# Altium schematic sheet 电源模块.SchDoc
size A3
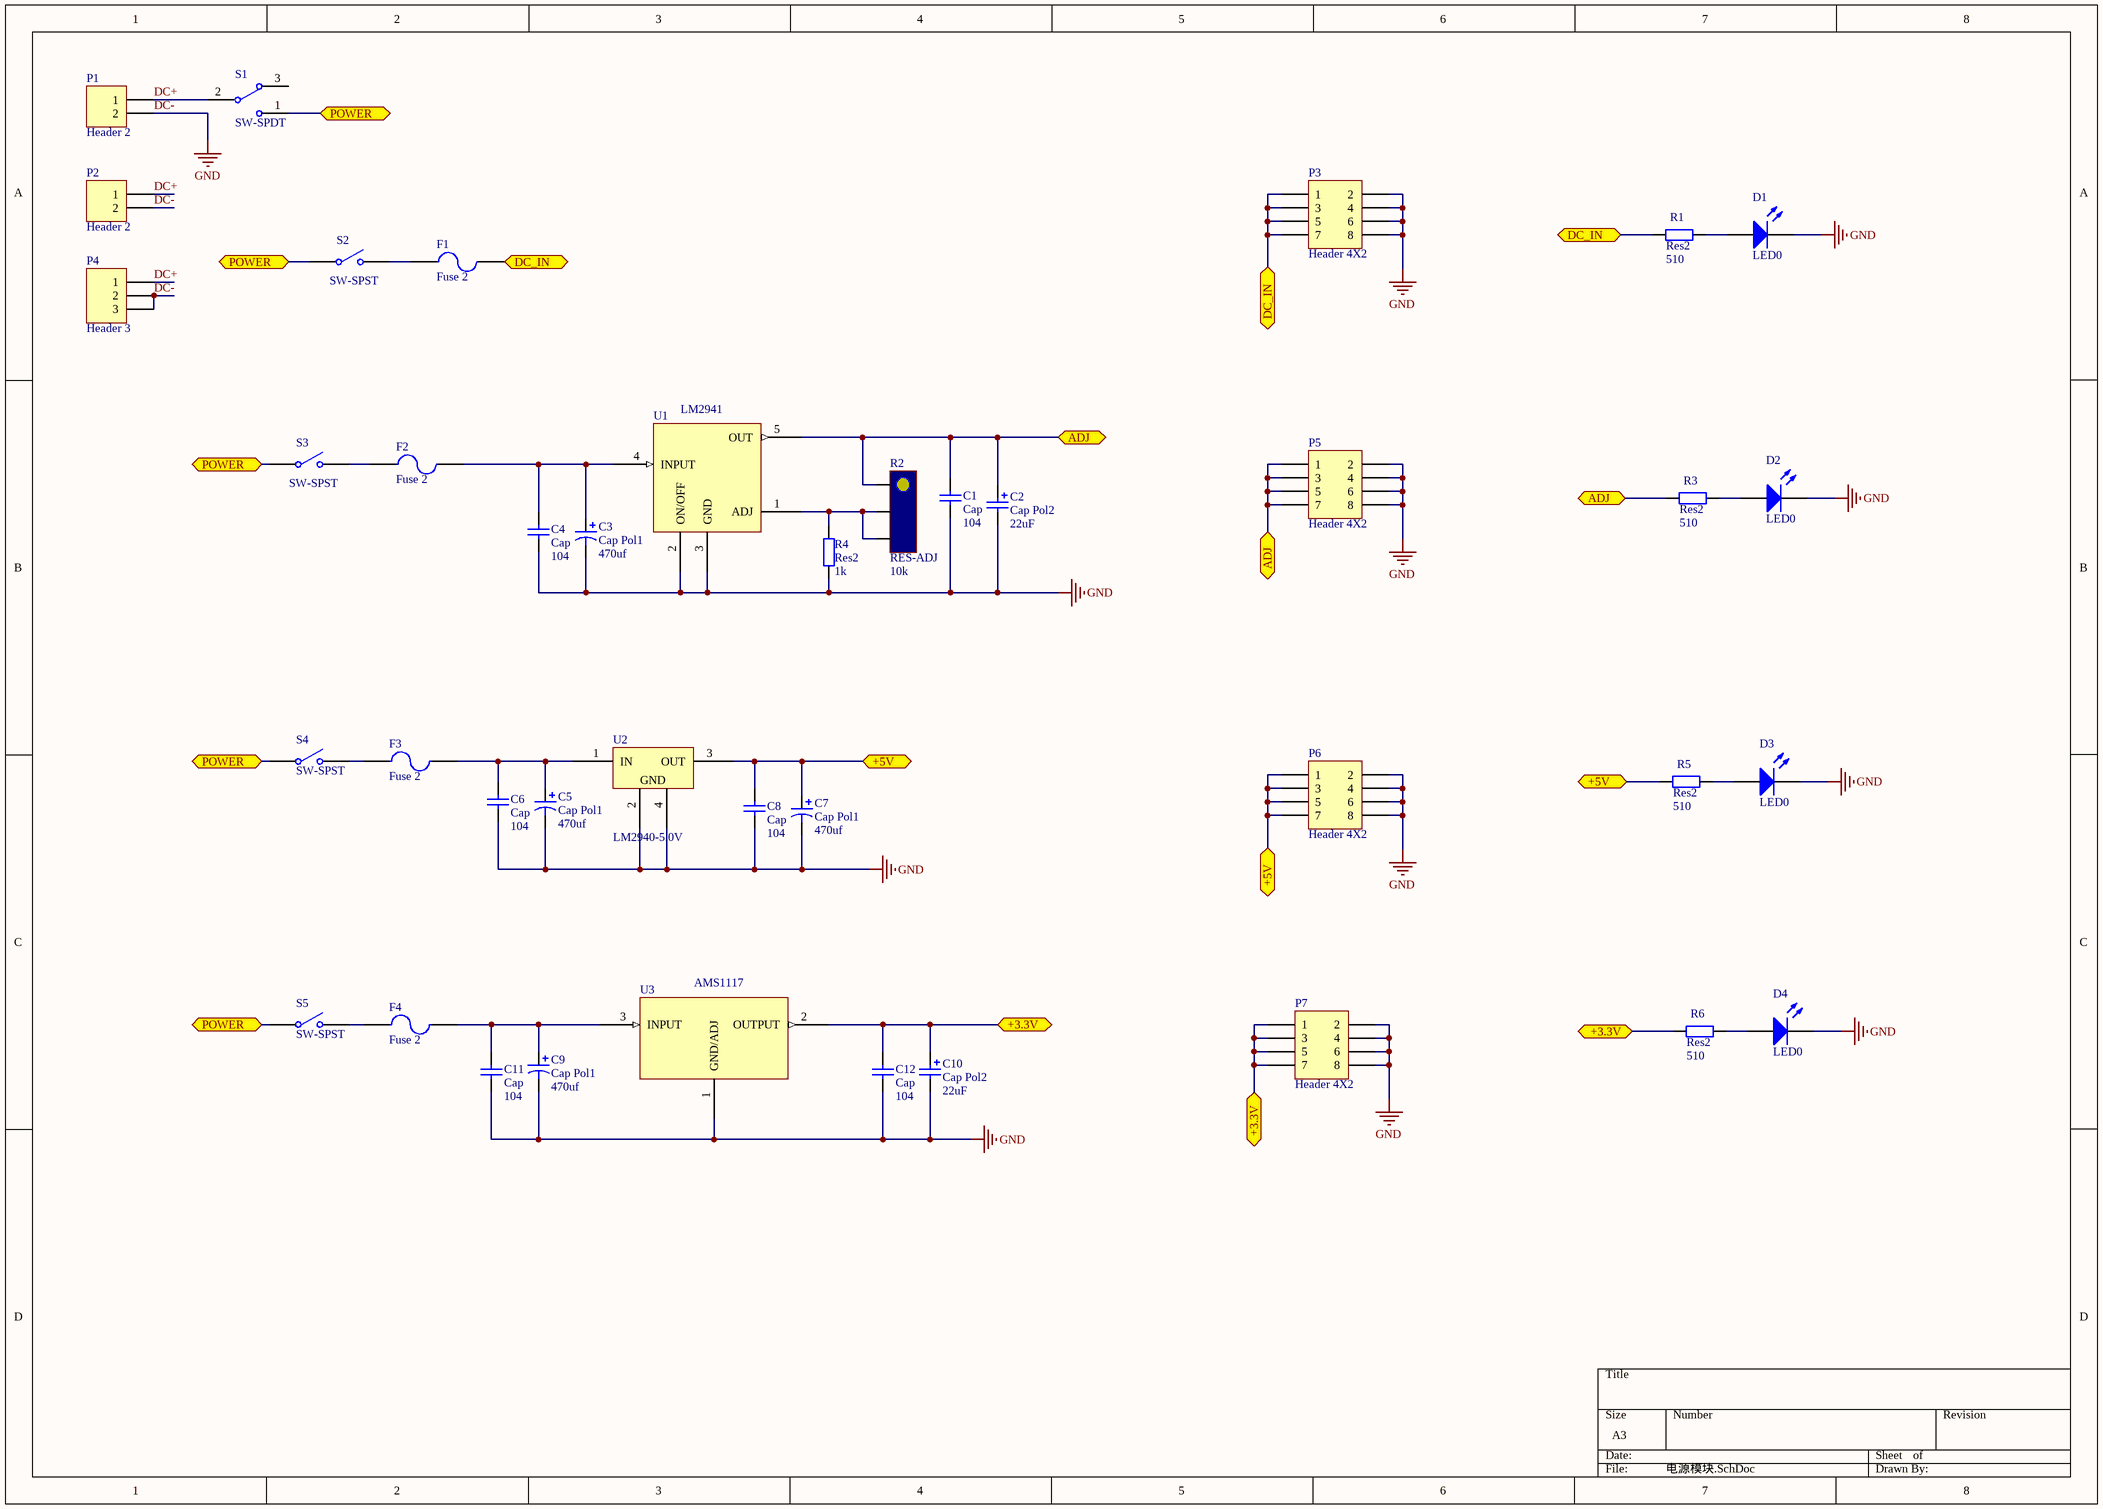
[diagram p0: 电源模块.SchDoc]

## Parts
C1  Cap  value 104  [C-0805]
C2  Cap Pol2  value 22uF  [C-RB-8]
C3  Cap Pol1  value 470uf  [CAP-E1]
C4  Cap  value 104  [C-0805]
C5  Cap Pol1  value 470uf  [CAP-E1]
C6  Cap  value 104  [C-0805]
C7  Cap Pol1  value 470uf  [CAP-E1]
C8  Cap  value 104  [C-0805]
C9  Cap Pol1  value 470uf  [CAP-E1]
C10  Cap Pol2  value 22uF  [C-RB-8]
C11  Cap  value 104  [C-0805]
C12  Cap  value 104  [C-0805]
D1  LED0  [LED]
D2  LED0  [LED]
D3  LED0  [LED]
D4  LED0  [LED]
F1  Fuse 2  [1206]
F2  Fuse 2  [1206]
F3  Fuse 2  [1206]
F4  Fuse 2  [1206]
P1  Header 2  [T型插头(公)]
P2  Header 2  [HDR1X2]
P3  Header 4X2  [HDR2X4]
P4  Header 3  [DC-005]
P5  Header 4X2  [HDR2X4]
P6  Header 4X2  [HDR2X4]
P7  Header 4X2  [HDR2X4]
R1  Res2  value 510  [0805]
R2  RES-ADJ  value 10k  [RES_V]
R3  Res2  value 510  [0805]
R4  Res2  value 1k  [0805]
R5  Res2  value 510  [0805]
R6  Res2  value 510  [0805]
S1  SW-SPDT  [SWITCH_B]
S2  SW-SPST  [SW-6pin]
S3  SW-SPST  [SW-6pin]
S4  SW-SPST  [SW-6pin]
S5  SW-SPST  [SW-6pin]
U1  LM2941  [LM2941]
U2  LM2940-5.0V  [TO-263-3]
U3  AMS1117  [AMS1117]

## Ports
+3.3V, +5V, ADJ, DC_IN, POWER

## Nets
DC-: C1.2 C2.2 C3.2 C4.2 C5.2 C6.2 C7.2 C8.2 C9.2 C10.2 C11.2 C12.2 D1.2(K) D2.2(K) D3.2(K) D4.2(K) P1.2 P2.2 P3.2 P3.4 P3.6 P3.8 P4.2 P4.3 P5.2 P5.4 P5.6 P5.8 P6.2 P6.4 P6.6 P6.8 P7.2 P7.4 P7.6 P7.8 R4.1 U1.2(ON/OFF) U1.3(GND) U2.2(GND) U2.4(GND) U3.1(GND/ADJ)  [also labelled GND]
+3.3V: C10.1 C12.1 P7.1 P7.3 P7.5 P7.7 R6.1 U3.2(OUTPUT) ; port +3.3V
+5V: C7.1 C8.1 P6.1 P6.3 P6.5 P6.7 R5.1 U2.3(OUT) ; port +5V
ADJ: C1.1 C2.1 P5.1 P5.3 P5.5 P5.7 R2.3 R3.1 U1.5(OUT) ; port ADJ
DC+: P1.1 P2.1 P4.1 S1.2
DC_IN: F1.2 P3.1 P3.3 P3.5 P3.7 R1.1 ; port DC_IN
POWER: S1.1 S2.1(COMMON) S3.1(COMMON) S4.1(COMMON) S5.1(COMMON) ; port POWER
NetC3_1: C3.1 C4.1 F2.2 U1.4(INPUT)
NetC5_1: C5.1 C6.1 F3.2 U2.1(IN)
NetC9_1: C9.1 C11.1 F4.2 U3.3(INPUT)
NetD1_1: D1.1(A) R1.2
NetD2_1: D2.1(A) R3.2
NetD3_1: D3.1(A) R5.2
NetD4_1: D4.1(A) R6.2
NetF1_1: F1.1 S2.2(NO)
NetF2_1: F2.1 S3.2(NO)
NetF3_1: F3.1 S4.2(NO)
NetF4_1: F4.1 S5.2(NO)
NetR2_1: R2.1 R2.2 R4.2 U1.1(ADJ)

Not connected (* = marked no-connect by the designer): S1 3

## Library data of the parts
C1 C4 C6 C8 C11 C12 = Cap: Capacitor; Published: 8-Jun-2000; LatestRevisionDate: 17-Jul-2002; LatestRevisionNote: Re-released for DXP Platform.; PackageReference: RAD-0.3; Publisher: Altium Limited; PackageDescription: Radial Cap, Thru-Hole; 2 Leads; 0.3 in Pin Spacing
C2 C10 = Cap Pol2: Polarized Capacitor (Axial); Published: 8-Jun-2000; LatestRevisionDate: 17-Jul-2002; LatestRevisionNote: Re-released for DXP Platform.; PackageReference: POLAR0.8; Publisher: Altium Limited; PackageDescription: Polarized Capacitor; 2 Leads
C3 C5 C7 C9 = Cap Pol1: Polarized Capacitor (Radial); Published: 8-Jun-2000; LatestRevisionDate: 17-Jul-2002; LatestRevisionNote: Re-released for DXP Platform.; PackageReference: RB7.6-15; Publisher: Altium Limited; PackageDescription: Polarized Capacitor (Radial); 2 Leads
D1-D4 = LED0: Typical INFRARED GaAs LED; Published: 8-Jun-2000; LatestRevisionDate: 08-Jul-2005; LatestRevisionNote: Mech Layer 1 removed.; PackageReference: LED-0; Publisher: Altium Limited; PackageDescription: LED; 2 Leads
F1-F4 = Fuse 2: Fuse; Published: 8-Jun-2000; LatestRevisionDate: 17-Jul-2002; LatestRevisionNote: Re-released for DXP Platform.; PackageReference: PIN-W2/E2.8; Publisher: Altium Limited; PackageDescription: Thru-Hole; 2 Leads
P1 P2 = Header 2: Header, 2-Pin; LatestRevisionDate: 17-Jul-2002; LatestRevisionNote: Re-released for DXP Platform.; Publisher: Altium Limited
P3 P5-P7 = Header 4X2: Header, 4-Pin, Dual row; LatestRevisionDate: 17-Jul-2002; LatestRevisionNote: Re-released for DXP Platform.; Publisher: Altium Limited
P4 = Header 3: Header, 3-Pin; LatestRevisionDate: 17-Jul-2002; LatestRevisionNote: Re-released for DXP Platform.; Publisher: Altium Limited
R1 R3-R6 = Res2: Resistor; Published: 8-Jun-2000; LatestRevisionDate: 17-Jul-2002; LatestRevisionNote: Re-released for DXP Platform.; PackageReference: AXIAL-0.4; Publisher: Altium Limited; PackageDescription: Axial Device, Thru-Hole; 2 Leads; 0.4 in Pin Spacing
S1 = SW-SPDT: SPDT Subminiature Toggle Switch, Right Angle Mounting, Vertical Actuation; Published: 24-Mar-1999; LatestRevisionDate: 17-Dec-2003; LatestRevisionNote: Schematic revised, PCB Footprint replaced.; DatasheetVersion: 05-Dec-2000; PackageReference: TL36WW15050; Publisher: Altium Limited; PackageDescription: Switch; 4 Leads; ComponentLink1Description: Manufacturer Link; ComponentLink1URL: http://www.apem.com
S2-S5 = SW-SPST: Single-Pole, Single-Throw Switch; Published: 24-Mar-1999; LatestRevisionDate: 17-Jul-2002; LatestRevisionNote: Re-released for DXP Platform.; PackageReference: SPST-2; Publisher: Altium Limited; PackageDescription: Switch; 2 Leads
U2 = LM2940: 5V稳压芯片